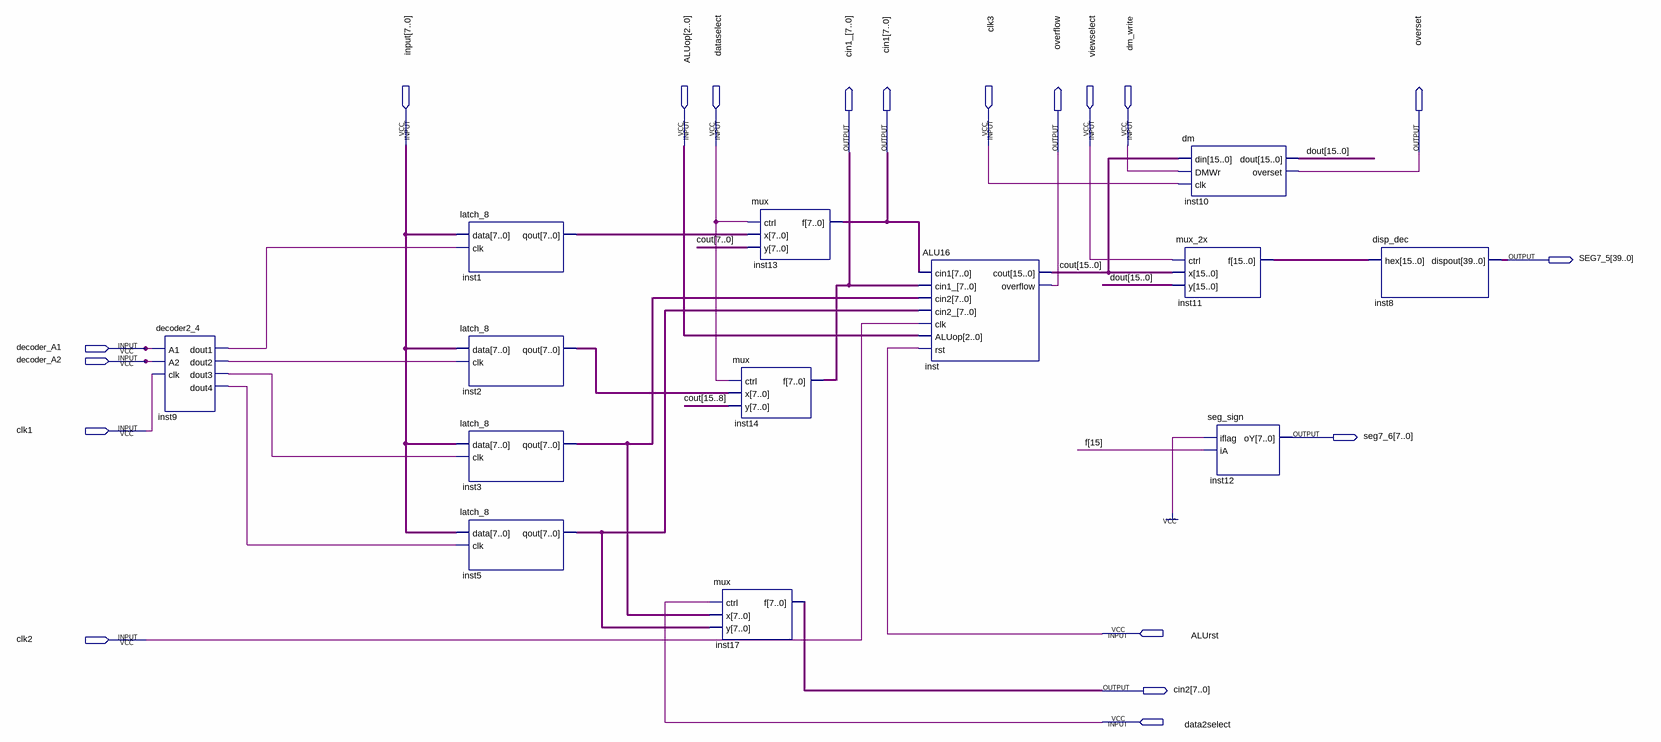
[diagram p0: schematic sheet]
// Quartus schematic BLOCK1.bdf as structural Verilog: 13 symbols, 19 pins
module BLOCK1 (
  input  [7:0] \input ,
  input  [2:0] ALUop,
  input  dataselect,
  input  clk3,
  input  viewselect,
  input  dm_write,
  input  decoder_A1,
  input  decoder_A2,
  input  clk1,
  input  ALUrst,
  input  clk2,
  input  data2select,
  output [7:0] cin1_,
  output [7:0] cin1,
  output overflow,
  output overset,
  output [39:0] SEG7_5,
  output [7:0] seg7_6,
  output [7:0] cin2
);

  wire inst9_dout1, inst9_dout2, inst9_dout3, inst9_dout4;
  wire [7:0] inst1_qout, inst2_qout, inst3_qout, inst5_qout;
  wire [15:0] cout, dout, f;

  decoder2_4 inst9 (
    .A1(decoder_A1), .A2(decoder_A2), .clk(clk1), .dout1(inst9_dout1), .dout2(inst9_dout2),
    .dout3(inst9_dout3), .dout4(inst9_dout4));
  latch_8 inst1 (.data(\input ), .clk(inst9_dout1), .qout(inst1_qout));
  latch_8 inst2 (.data(\input ), .clk(inst9_dout2), .qout(inst2_qout));
  latch_8 inst3 (.data(\input ), .clk(inst9_dout3), .qout(inst3_qout));
  latch_8 inst5 (.data(\input ), .clk(inst9_dout4), .qout(inst5_qout));
  mux inst14 (.ctrl(dataselect), .x(inst2_qout), .y(cout[15:8]), .f(cin1_));
  mux inst17 (.ctrl(data2select), .x(inst3_qout), .y(inst5_qout), .f(cin2));
  mux inst13 (.ctrl(dataselect), .x(inst1_qout), .y(cout[7:0]), .f(cin1));
  ALU16 inst (
    .cin1(cin1), .cin1_(cin1_), .cin2(inst3_qout), .cin2_(inst5_qout), .clk(clk2), .ALUop(ALUop),
    .rst(ALUrst), .cout(cout), .overflow(overflow));
  dm inst10 (.din(cout), .DMWr(dm_write), .clk(clk3), .dout(dout), .overset(overset));
  mux_2x inst11 (.ctrl(viewselect), .x(cout), .y(dout), .f(f));
  seg_sign inst12 (.iflag(1'b1), .iA(f[15]), .oY(seg7_6));
  disp_dec inst8 (.hex(f), .dispout(SEG7_5));
endmodule
